# Altium schematic sheet 02_ULTRASONIC_PGA460.SchDoc
size 420 x 297 mm; Author: Войлоков В. В.; CompanyName: ВГТУ РП-233; SheetNumber: 2; SheetTotal: 5; DecimalNumber: ВГТУ.436224.001; Name1: Приемопередатчик; Name2: ультразвуковой
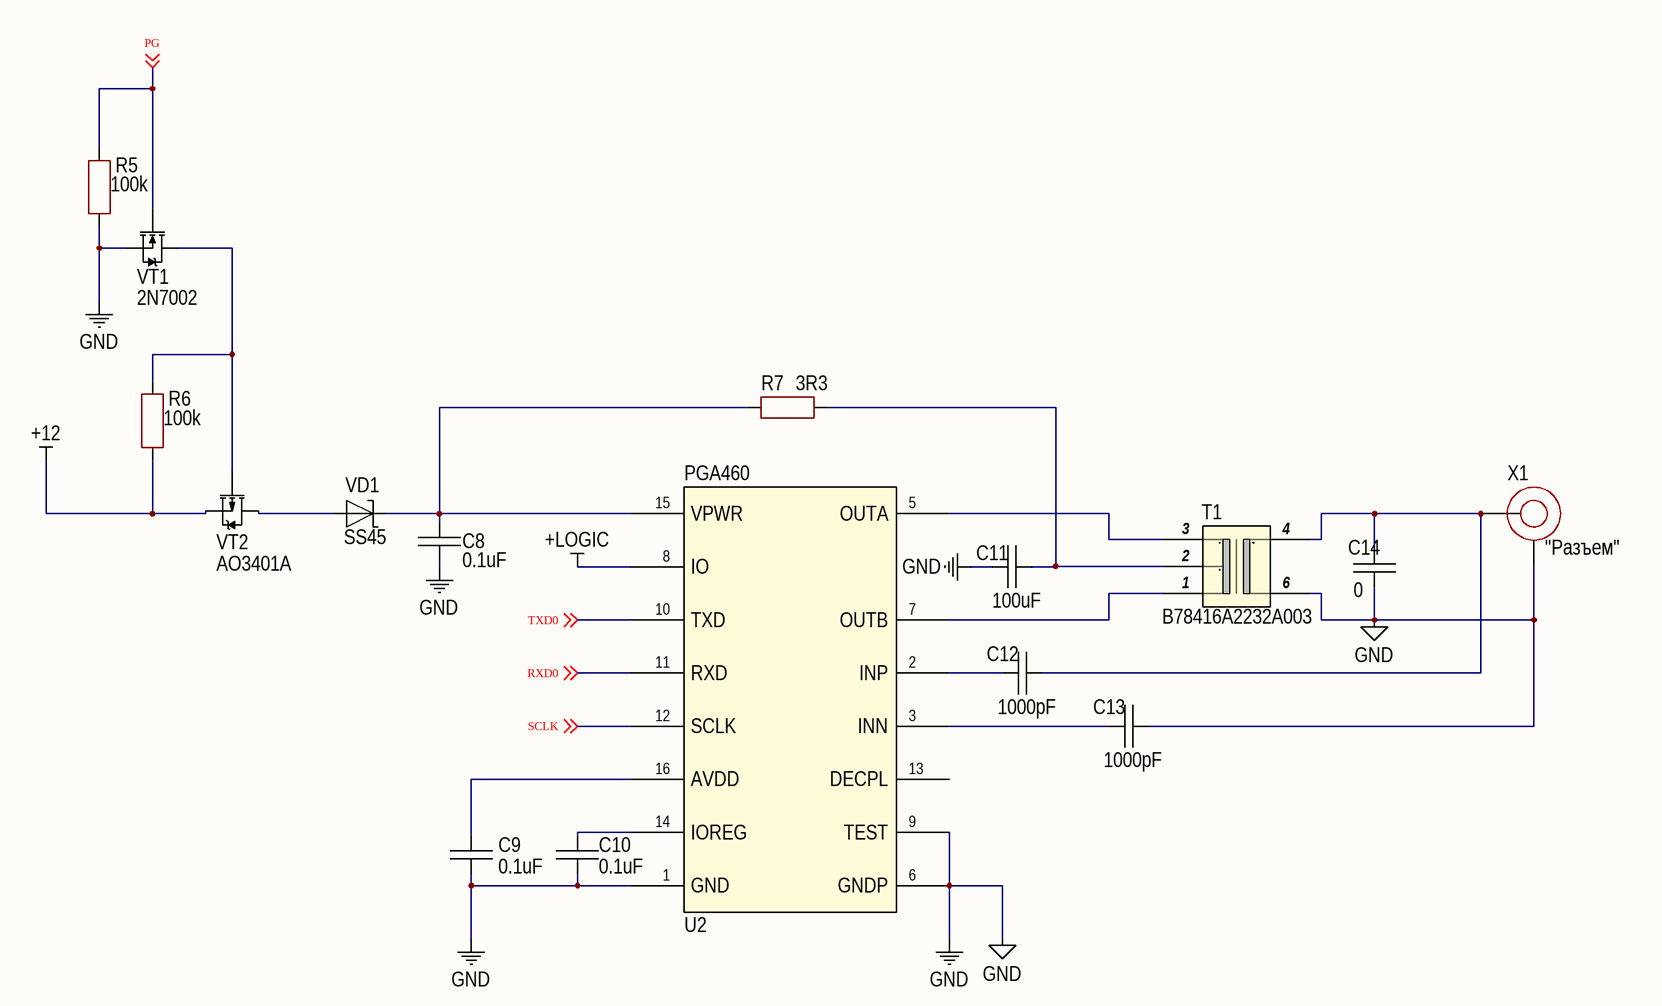
[diagram p0: 02_ULTRASONIC_PGA460.SchDoc]

## Parts
C8  value 0.1uF  [CAP: 0603]
C9  value 0.1uF  [CAP: 0603]
C10  value 0.1uF  [CAP: 0603]
C11  value 100uF  [CAP: 1206]
C12  value 1000pF  [CAP: 0805]
C13  value 1000pF  [CAP: 0805]
C14  value 0  [CAP: 0805]
R5  value 100k  [RES: 0603]
R6  value 100k  [RES: 0603]
R7  value 3R3  [RES: 2010]
T1  B78416A2232A003  [B78416_TDK]
U2  PGA460  [16-TSSOP]
VD1  PartNumber: SS45  [DIODE: SMC]
VT1  PartNumber: 2N7002  [SOT23]
VT2  PartNumber: AO3401A  [SOT23]
X1  CommentText: "Разъем"  [CON: SMA]

## Nets
+12: R6.1 VT2.2(S)
+LOGIC: U2.8(IO)
GND: C8.1 C9.1 C10.1 C11.2 C13.1 C14.2 R5.1 T1.6 U2.1(GND) U2.6(GNDP) U2.9(TEST) VT1.2(S) X1.2
PG: R5.2 VT1.1(G) ; off-sheet PG
RXD0: U2.11(RXD) ; off-sheet RXD0
SCLK: U2.12(SCLK) ; off-sheet SCLK
TXD0: U2.10(TXD) ; off-sheet TXD0
NetC8_2: C8.2 R7.1 U2.15(VPWR) VD1.2
NetC9_2: C9.2 U2.16(AVDD)
NetC10_2: C10.2 U2.14(IOREG)
NetC11_1: C11.1 R7.2 T1.2
NetC12_1: C12.1 C14.1 T1.4 X1.1
NetC12_2: C12.2 U2.2(INP)
NetC13_2: C13.2 U2.3(INN)
NetR6_2: R6.2 VT1.3(D) VT2.1(G)
NetT1_1: T1.1 U2.7(OUTB)
NetT1_3: T1.3 U2.5(OUTA)
NetVD1_1: VD1.1 VT2.3(D)

Not connected (* = marked no-connect by the designer): U2 13(DECPL)

## Notes on the sheet
- Перв.примен.
- Справ.№
- Подп. и дата
- Инв.№ дубл.
- Взам.инв.№
- Подп.и дата
- Разраб.
- Изм.
- Лист
- № докум.
- Подп.
- Дата
- Лит.
- Масштаб
- Масса
- Т.контр.
- Пров.
- СХЕМА   ЭЛЕКТРИЧЕСКАЯ
- ПРИНЦИПИАЛЬНАЯ
- Листов
- Инв.№ подл.
- Утв.
- Н.контр.
- Нач.сект.
- Формат  A3

## Library data of the parts
C8-C10 = Ceramic_0603: Manufacturer: Yageo; PartNumber: CC0603KRX7R7BB104; ValueManufacturerPartNumber: Ceramic capacitor, 0.1uF, X7R, ±10%, 16V, 0603, -55...+125°C; TypeCapacitor: Ceramic capacitor; Tolerance: ±10%; TypeDielectric: X7R; Voltage: 16V; Package: 0603; HelpURL: https://www.digikey.com/product-detail/en/yageo/CC0603KRX7R7BB104/311-1088-1-ND/302998; Temperature: -55...+125°C
C11 = Ceramic_1206: Manufacturer: Yageo; PartNumber: CC1206KRX7R9BB104; ValueManufacturerPartNumber: Ceramic capacitor, 100uF, X7R, ±10%, 50V, 1206, -55...+125°C; TypeCapacitor: Ceramic capacitor; Tolerance: ±10%; TypeDielectric: X7R; Voltage: 50V; Package: 1206; HelpURL: https://www.digikey.com/product-detail/en/yageo/CC1206KRX7R9BB104/311-1179-1-ND/303089; Temperature: -55...+125°C
C12 C13 = Ceramic_0805: Manufacturer: Yageo; PartNumber: CC0805KRX7R7BB104; ValueManufacturerPartNumber: Ceramic capacitor, 1000pF, NP0, ±5%, 500V, 0805, -55...+125°C; TypeCapacitor: Ceramic capacitor; Tolerance: ±5%; TypeDielectric: NP0; Voltage: 500V; Package: 0805; HelpURL: https://www.digikey.com/product-detail/en/yageo/CC0805KRX7R7BB104/311-1142-1-ND/303052; Temperature: -55...+125°C
C14 = Ceramic_0805: Manufacturer: Yageo; PartNumber: CC0805KRX7R7BB104; ValueManufacturerPartNumber: Ceramic capacitor, 0, NP0, ±5%, 16V, 0805, -55...+125°C; TypeCapacitor: Ceramic capacitor; Tolerance: ±5%; TypeDielectric: NP0; Voltage: 16V; Package: 0805; HelpURL: https://www.digikey.com/product-detail/en/yageo/CC0805KRX7R7BB104/311-1142-1-ND/303052; Temperature: -55...+125°C
R5 R6 = Resistor_0603: Manufacturer: Yageo; PartNumber: RC0603JR-07100RL; ValueManufacturerPartNumber: Resistor film, 100k, ±5%, 0603, 0.1W, -55...+125°C; TypeResistor: Resistor film; Power: 0.1W; Tolerance: ±5%; Package: 0603; HelpURL: https://www.digikey.com/product-detail/en/yageo/RC0603JR-07100RL/311-100GRCT-ND/729644; Temperature: -55...+125°C
R7 = Resistor_2010: Manufacturer: Yageo; PartNumber: RC2010JK-07100RL; ValueManufacturerPartNumber: Resistor film, 3R3, ±5%, 2010, 0.75W, -55...+125°C; TypeResistor: Resistor film; Power: 0.75W; Tolerance: ±5%; Package: 2010; HelpURL: https://www.digikey.com/product-detail/en/yageo/RC2010JK-07100RL/YAG3381CT-ND/5962203; Temperature: -55...+125°C
T1 = B78416A2232A003: Description; Manufacturer_Name: TDK; Copyright: Copyright (C) 2025 Ultra Librarian. All rights reserved.; Manufacturer_Part_Number: B78416A2232A003; RefDes: RefDes; Type: Type
U2 = PGA460: pin to pad: 1>1+4
VD1 = Schottky_single: Manufacturer: Diodes Incorporated; ValueManufacturerPartNumber: Schottky diode, 80V, 500mA, 1V, 15pF, SOD-123, -55...+150°C; TypeDiode: Schottky diode; Voltage: 80V; Current: 500mA; VoltageDrop: 1V; RecoveryTime: 15pF; Package: SOD-123; HelpURL: https://www.digikey.com/product-detail/en/diodes-incorporated/MBR0580S1-7/MBR0580S1-7DICT-ND/5080371; Temperature: -55...+150°C
VT1 = MOSFET_N_132: Manufacturer: Infineon Technologies; ValueManufacturerPartNumber: MOSFET N-channel transistor, 80V, 7A, 9.1nC, 2.5W, 34mOhm, 756pF, 8-TDSON, -55...+150°C; TypeTransistor: MOSFET N-channel transistor; VoltageDS: 80V; CurrentDS: 7A; RDS: 34mOhm; GateCharge: 9.1nC; InputCapacitor: 756pF; MaxPower: 2.5W; Package: 8-TDSON; HelpURL: https://www.digikey.com/product-detail/en/infineon-technologies/BSC340N08NS3GATMA1/BSC340N08NS3GATMA1TR-ND/2080655; Temperature: -55...+150°C
VT2 = MOSFET_P_132: Manufacturer: Infineon Technologies; ValueManufacturerPartNumber: MOSFET P-channel transistor, 20V, 2.6A, 2.9nC, 2.5W, 135mOhm, 220pF, SOT-23, -55...+150°C; TypeTransistor: MOSFET P-channel transistor; VoltageDS: 20V; CurrentDS: 2.6A; RDS: 135mOhm; GateCharge: 2.9nC; InputCapacitor: 220pF; MaxPower: 2.5W; Package: SOT-23; HelpURL: https://www.digikey.com/product-detail/en/infineon-technologies/IRLML2246TRPBF/IRLML2246TRPBFCT-ND/2639576; Temperature: -55...+150°C
X1 = Connector_SMA: Manufacturer: TE Connectivity; ValueManufacturerPartNumber: Connector SMA, 50 Ohm, 3GHz; PartNumber: 5-1814832-1; TypeConnector: Connector SMA; Frequency: 3GHz; Impedance: 50 Ohm; HelpURL: https://www.digikey.com/product-detail/en/te-connectivity-amp-connectors/5-1814832-1/A97594-ND/1755982